# Altium schematic sheet BCK_REVA_3.SchDoc
size A4; SheetNumber: 3; SheetTotal: 3
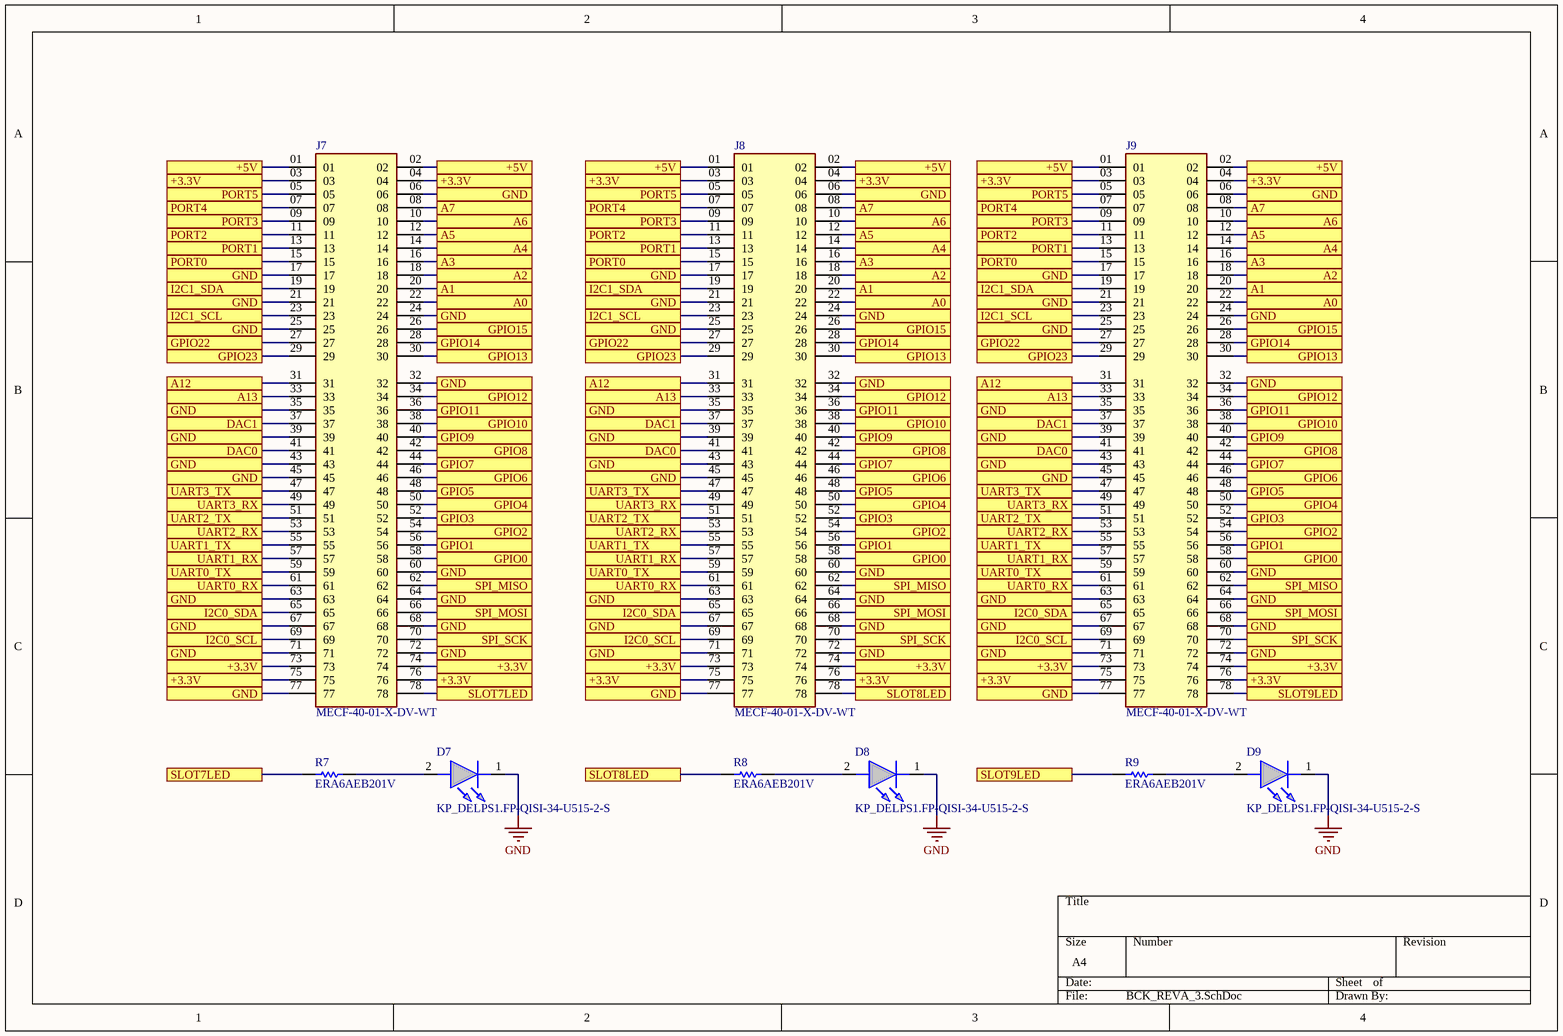
[diagram p0: BCK_REVA_3.SchDoc]

## Parts
D7  KP_DELPS1.FP-QISI-34-U515-2-S  [KPDELPS1FPQISI34U5152S]
D8  KP_DELPS1.FP-QISI-34-U515-2-S  [KPDELPS1FPQISI34U5152S]
D9  KP_DELPS1.FP-QISI-34-U515-2-S  [KPDELPS1FPQISI34U5152S]
J7  MECF-40-01-X-DV-WT  [SAMTEC_MECF-40-01-X-DV-WT]
J8  MECF-40-01-X-DV-WT  [SAMTEC_MECF-40-01-X-DV-WT]
J9  MECF-40-01-X-DV-WT  [SAMTEC_MECF-40-01-X-DV-WT]
R7  ERA6AEB201V  [RESC2013X60X40NL20T25]
R8  ERA6AEB201V  [RESC2013X60X40NL20T25]
R9  ERA6AEB201V  [RESC2013X60X40NL20T25]

## Ports
+3.3V (see BCK_REVA[1A], BCK_REVA[1C], BCK_REVA[2A], BCK_REVA[2C], BCK_REVA[3A], BCK_REVA[3C], BCK_REVA[4A], BCK_REVA[4C], BCK_REVA_2[1A], BCK_REVA_2[1C], BCK_REVA_2[2A], BCK_REVA_2[2C], BCK_REVA_2[3A], BCK_REVA_2[3C], BCK_REVA_2[4A], BCK_REVA_2[4C], BCK_REVA_3[1A], BCK_REVA_3[1C], BCK_REVA_3[2A], BCK_REVA_3[2C], BCK_REVA_3[3A], BCK_REVA_3[3C], BCK_REVA_3[4A], BCK_REVA_3[4C]), +3.3V (see BCK_REVA[1A], BCK_REVA[1C], BCK_REVA[2A], BCK_REVA[2C], BCK_REVA[3A], BCK_REVA[3C], BCK_REVA[4A], BCK_REVA[4C], BCK_REVA_2[1A], BCK_REVA_2[1C], BCK_REVA_2[2A], BCK_REVA_2[2C], BCK_REVA_2[3A], BCK_REVA_2[3C], BCK_REVA_2[4A], BCK_REVA_2[4C], BCK_REVA_3[1A], BCK_REVA_3[1C], BCK_REVA_3[2A], BCK_REVA_3[2C], BCK_REVA_3[3A], BCK_REVA_3[3C], BCK_REVA_3[4C]), +3.3V (see BCK_REVA[1A], BCK_REVA[1C], BCK_REVA[2A], BCK_REVA[2C], BCK_REVA[3A], BCK_REVA[3C], BCK_REVA[4A], BCK_REVA[4C], BCK_REVA_2[1A], BCK_REVA_2[1C], BCK_REVA_2[2A], BCK_REVA_2[2C], BCK_REVA_2[3A], BCK_REVA_2[3C], BCK_REVA_2[4A], BCK_REVA_2[4C], BCK_REVA_3[1C], BCK_REVA_3[2A], BCK_REVA_3[2C], BCK_REVA_3[3A], BCK_REVA_3[3C], BCK_REVA_3[4A], BCK_REVA_3[4C]), +5V (see BCK_REVA[1A], BCK_REVA[2A], BCK_REVA[3A], BCK_REVA[4A], BCK_REVA_2[1A], BCK_REVA_2[2A], BCK_REVA_2[3A], BCK_REVA_2[4A], BCK_REVA_3[1A], BCK_REVA_3[2A], BCK_REVA_3[3A]), +5V (see BCK_REVA[1A], BCK_REVA[2A], BCK_REVA[3A], BCK_REVA[4A], BCK_REVA_2[1A], BCK_REVA_2[2A], BCK_REVA_2[3A], BCK_REVA_2[4A], BCK_REVA_3[1A], BCK_REVA_3[2A], BCK_REVA_3[3A], BCK_REVA_3[4A]), +5V (see BCK_REVA[1A], BCK_REVA[2A], BCK_REVA[3A], BCK_REVA[4A], BCK_REVA_2[1A], BCK_REVA_2[2A], BCK_REVA_2[3A], BCK_REVA_2[4A], BCK_REVA_3[2A], BCK_REVA_3[3A], BCK_REVA_3[4A]), A0 (see BCK_REVA[2B], BCK_REVA[3B], BCK_REVA[4B], BCK_REVA_2[2B], BCK_REVA_2[3B], BCK_REVA_2[4B], BCK_REVA_3[2B], BCK_REVA_3[3B]), A0 (see BCK_REVA[2B], BCK_REVA[3B], BCK_REVA[4B], BCK_REVA_2[2B], BCK_REVA_2[3B], BCK_REVA_2[4B], BCK_REVA_3[2B], BCK_REVA_3[4B]), A0 (see BCK_REVA[2B], BCK_REVA[3B], BCK_REVA[4B], BCK_REVA_2[2B], BCK_REVA_2[3B], BCK_REVA_2[4B], BCK_REVA_3[3B], BCK_REVA_3[4B]), A1 (see BCK_REVA[2B], BCK_REVA[3B], BCK_REVA[4B], BCK_REVA_2[2B], BCK_REVA_2[3B], BCK_REVA_2[4B], BCK_REVA_3[2B], BCK_REVA_3[3B]), A1 (see BCK_REVA[2B], BCK_REVA[3B], BCK_REVA[4B], BCK_REVA_2[2B], BCK_REVA_2[3B], BCK_REVA_2[4B], BCK_REVA_3[2B], BCK_REVA_3[4B]), A1 (see BCK_REVA[2B], BCK_REVA[3B], BCK_REVA[4B], BCK_REVA_2[2B], BCK_REVA_2[3B], BCK_REVA_2[4B], BCK_REVA_3[3B], BCK_REVA_3[4B]), A2 (see BCK_REVA[2B], BCK_REVA[3B], BCK_REVA[4B], BCK_REVA_2[2B], BCK_REVA_2[3B], BCK_REVA_2[4B], BCK_REVA_3[2B], BCK_REVA_3[3B]), A2 (see BCK_REVA[2B], BCK_REVA[3B], BCK_REVA[4B], BCK_REVA_2[2B], BCK_REVA_2[3B], BCK_REVA_2[4B], BCK_REVA_3[2B], BCK_REVA_3[4B]), A2 (see BCK_REVA[2B], BCK_REVA[3B], BCK_REVA[4B], BCK_REVA_2[2B], BCK_REVA_2[3B], BCK_REVA_2[4B], BCK_REVA_3[3B], BCK_REVA_3[4B]), A3 (see BCK_REVA[2B], BCK_REVA[3B], BCK_REVA[4B], BCK_REVA_2[2B], BCK_REVA_2[3B], BCK_REVA_2[4B], BCK_REVA_3[2B], BCK_REVA_3[3B]), A3 (see BCK_REVA[2B], BCK_REVA[3B], BCK_REVA[4B], BCK_REVA_2[2B], BCK_REVA_2[3B], BCK_REVA_2[4B], BCK_REVA_3[2B], BCK_REVA_3[4B]), A3 (see BCK_REVA[2B], BCK_REVA[3B], BCK_REVA[4B], BCK_REVA_2[2B], BCK_REVA_2[3B], BCK_REVA_2[4B], BCK_REVA_3[3B], BCK_REVA_3[4B]), A4 (see BCK_REVA[2A], BCK_REVA[3A], BCK_REVA[4A], BCK_REVA_2[2A], BCK_REVA_2[3A], BCK_REVA_2[4A], BCK_REVA_3[2A], BCK_REVA_3[3A]), A4 (see BCK_REVA[2A], BCK_REVA[3A], BCK_REVA[4A], BCK_REVA_2[2A], BCK_REVA_2[3A], BCK_REVA_2[4A], BCK_REVA_3[2A], BCK_REVA_3[4A]), A4 (see BCK_REVA[2A], BCK_REVA[3A], BCK_REVA[4A], BCK_REVA_2[2A], BCK_REVA_2[3A], BCK_REVA_2[4A], BCK_REVA_3[3A], BCK_REVA_3[4A]), A5 (see BCK_REVA[2A], BCK_REVA[3A], BCK_REVA[4A], BCK_REVA_2[2A], BCK_REVA_2[3A], BCK_REVA_2[4A], BCK_REVA_3[2A], BCK_REVA_3[3A]), A5 (see BCK_REVA[2A], BCK_REVA[3A], BCK_REVA[4A], BCK_REVA_2[2A], BCK_REVA_2[3A], BCK_REVA_2[4A], BCK_REVA_3[2A], BCK_REVA_3[4A]), A5 (see BCK_REVA[2A], BCK_REVA[3A], BCK_REVA[4A], BCK_REVA_2[2A], BCK_REVA_2[3A], BCK_REVA_2[4A], BCK_REVA_3[3A], BCK_REVA_3[4A]), A6 (see BCK_REVA[2A], BCK_REVA[3A], BCK_REVA[4A], BCK_REVA_2[2A], BCK_REVA_2[3A], BCK_REVA_2[4A], BCK_REVA_3[2A], BCK_REVA_3[3A]), A6 (see BCK_REVA[2A], BCK_REVA[3A], BCK_REVA[4A], BCK_REVA_2[2A], BCK_REVA_2[3A], BCK_REVA_2[4A], BCK_REVA_3[2A], BCK_REVA_3[4A]), A6 (see BCK_REVA[2A], BCK_REVA[3A], BCK_REVA[4A], BCK_REVA_2[2A], BCK_REVA_2[3A], BCK_REVA_2[4A], BCK_REVA_3[3A], BCK_REVA_3[4A]), A7 (see BCK_REVA[2A], BCK_REVA[3A], BCK_REVA[4A], BCK_REVA_2[2A], BCK_REVA_2[3A], BCK_REVA_2[4A], BCK_REVA_3[2A], BCK_REVA_3[3A]), A7 (see BCK_REVA[2A], BCK_REVA[3A], BCK_REVA[4A], BCK_REVA_2[2A], BCK_REVA_2[3A], BCK_REVA_2[4A], BCK_REVA_3[2A], BCK_REVA_3[4A]), A7 (see BCK_REVA[2A], BCK_REVA[3A], BCK_REVA[4A], BCK_REVA_2[2A], BCK_REVA_2[3A], BCK_REVA_2[4A], BCK_REVA_3[3A], BCK_REVA_3[4A]), A12 (see BCK_REVA[1B], BCK_REVA[2B], BCK_REVA[3B], BCK_REVA_2[1B], BCK_REVA_2[2B], BCK_REVA_2[3B], BCK_REVA_3[1B], BCK_REVA_3[2B]), A12 (see BCK_REVA[1B], BCK_REVA[2B], BCK_REVA[3B], BCK_REVA_2[1B], BCK_REVA_2[2B], BCK_REVA_2[3B], BCK_REVA_3[1B], BCK_REVA_3[3B]), A12 (see BCK_REVA[1B], BCK_REVA[2B], BCK_REVA[3B], BCK_REVA_2[1B], BCK_REVA_2[2B], BCK_REVA_2[3B], BCK_REVA_3[2B], BCK_REVA_3[3B]), A13 (see BCK_REVA[1B], BCK_REVA[2B], BCK_REVA[3B], BCK_REVA_2[1B], BCK_REVA_2[2B], BCK_REVA_2[3B], BCK_REVA_3[1B], BCK_REVA_3[2B]), A13 (see BCK_REVA[1B], BCK_REVA[2B], BCK_REVA[3B], BCK_REVA_2[1B], BCK_REVA_2[2B], BCK_REVA_2[3B], BCK_REVA_3[1B], BCK_REVA_3[3B]), A13 (see BCK_REVA[1B], BCK_REVA[2B], BCK_REVA[3B], BCK_REVA_2[1B], BCK_REVA_2[2B], BCK_REVA_2[3B], BCK_REVA_3[2B], BCK_REVA_3[3B]), DAC0 (see BCK_REVA[1B], BCK_REVA[2B], BCK_REVA[3B], BCK_REVA_2[1B], BCK_REVA_2[2B], BCK_REVA_2[3B], BCK_REVA_3[1B], BCK_REVA_3[2B]), DAC0 (see BCK_REVA[1B], BCK_REVA[2B], BCK_REVA[3B], BCK_REVA_2[1B], BCK_REVA_2[2B], BCK_REVA_2[3B], BCK_REVA_3[1B], BCK_REVA_3[3B]), DAC0 (see BCK_REVA[1B], BCK_REVA[2B], BCK_REVA[3B], BCK_REVA_2[1B], BCK_REVA_2[2B], BCK_REVA_2[3B], BCK_REVA_3[2B], BCK_REVA_3[3B]), DAC1 (see BCK_REVA[1B], BCK_REVA[2B], BCK_REVA[3B], BCK_REVA_2[1B], BCK_REVA_2[2B], BCK_REVA_2[3B], BCK_REVA_3[1B], BCK_REVA_3[2B]), DAC1 (see BCK_REVA[1B], BCK_REVA[2B], BCK_REVA[3B], BCK_REVA_2[1B], BCK_REVA_2[2B], BCK_REVA_2[3B], BCK_REVA_3[1B], BCK_REVA_3[3B]), DAC1 (see BCK_REVA[1B], BCK_REVA[2B], BCK_REVA[3B], BCK_REVA_2[1B], BCK_REVA_2[2B], BCK_REVA_2[3B], BCK_REVA_3[2B], BCK_REVA_3[3B]), GND (see BCK_REVA[1B], BCK_REVA[1C], BCK_REVA[1D], BCK_REVA[2A], BCK_REVA[2B], BCK_REVA[2C], BCK_REVA[3A], BCK_REVA[3B], BCK_REVA[3C], BCK_REVA[4A], BCK_REVA[4B], BCK_REVA[4C], BCK_REVA_2[1B], BCK_REVA_2[1C], BCK_REVA_2[2A], BCK_REVA_2[2B], BCK_REVA_2[2C], BCK_REVA_2[3A], BCK_REVA_2[3B], BCK_REVA_2[3C], BCK_REVA_2[4A], BCK_REVA_2[4B], BCK_REVA_2[4C], BCK_REVA_3[1B], BCK_REVA_3[1C], BCK_REVA_3[2A], BCK_REVA_3[2B], BCK_REVA_3[2C], BCK_REVA_3[3A], BCK_REVA_3[3B], BCK_REVA_3[3C], BCK_REVA_3[4A], BCK_REVA_3[4B], BCK_REVA_3[4C]), GND (see BCK_REVA[1B], BCK_REVA[1C], BCK_REVA[1D], BCK_REVA[2A], BCK_REVA[2B], BCK_REVA[2C], BCK_REVA[3A], BCK_REVA[3B], BCK_REVA[3C], BCK_REVA[4A], BCK_REVA[4B], BCK_REVA[4C], BCK_REVA_2[1B], BCK_REVA_2[1C], BCK_REVA_2[2A], BCK_REVA_2[2B], BCK_REVA_2[2C], BCK_REVA_2[3A], BCK_REVA_2[3B], BCK_REVA_2[3C], BCK_REVA_2[4A], BCK_REVA_2[4B], BCK_REVA_2[4C], BCK_REVA_3[1B], BCK_REVA_3[1C], BCK_REVA_3[2A], BCK_REVA_3[2B], BCK_REVA_3[2C], BCK_REVA_3[3A], BCK_REVA_3[3B], BCK_REVA_3[3C], BCK_REVA_3[4B], BCK_REVA_3[4C]), GND (see BCK_REVA[1B], BCK_REVA[1C], BCK_REVA[1D], BCK_REVA[2A], BCK_REVA[2B], BCK_REVA[2C], BCK_REVA[3A], BCK_REVA[3B], BCK_REVA[3C], BCK_REVA[4A], BCK_REVA[4B], BCK_REVA[4C], BCK_REVA_2[1B], BCK_REVA_2[1C], BCK_REVA_2[2A], BCK_REVA_2[2B], BCK_REVA_2[2C], BCK_REVA_2[3A], BCK_REVA_2[3B], BCK_REVA_2[3C], BCK_REVA_2[4A], BCK_REVA_2[4B], BCK_REVA_2[4C], BCK_REVA_3[1B], BCK_REVA_3[1C], BCK_REVA_3[2A], BCK_REVA_3[2B], BCK_REVA_3[2C], BCK_REVA_3[3B], BCK_REVA_3[3C], BCK_REVA_3[4A], BCK_REVA_3[4B], BCK_REVA_3[4C]), GND (see BCK_REVA[1B], BCK_REVA[1C], BCK_REVA[1D], BCK_REVA[2A], BCK_REVA[2B], BCK_REVA[2C], BCK_REVA[3A], BCK_REVA[3B], BCK_REVA[3C], BCK_REVA[4A], BCK_REVA[4B], BCK_REVA[4C], BCK_REVA_2[1B], BCK_REVA_2[1C], BCK_REVA_2[2A], BCK_REVA_2[2B], BCK_REVA_2[2C], BCK_REVA_2[3A], BCK_REVA_2[3B], BCK_REVA_2[3C], BCK_REVA_2[4A], BCK_REVA_2[4B], BCK_REVA_2[4C], BCK_REVA_3[1B], BCK_REVA_3[1C], BCK_REVA_3[2B], BCK_REVA_3[2C], BCK_REVA_3[3A], BCK_REVA_3[3B], BCK_REVA_3[3C], BCK_REVA_3[4A], BCK_REVA_3[4B], BCK_REVA_3[4C]), GPIO0 (see BCK_REVA[2C], BCK_REVA[3C], BCK_REVA[4C], BCK_REVA_2[2C], BCK_REVA_2[3C], BCK_REVA_2[4C], BCK_REVA_3[2C], BCK_REVA_3[3C]), GPIO0 (see BCK_REVA[2C], BCK_REVA[3C], BCK_REVA[4C], BCK_REVA_2[2C], BCK_REVA_2[3C], BCK_REVA_2[4C], BCK_REVA_3[2C], BCK_REVA_3[4C]), GPIO0 (see BCK_REVA[2C], BCK_REVA[3C], BCK_REVA[4C], BCK_REVA_2[2C], BCK_REVA_2[3C], BCK_REVA_2[4C], BCK_REVA_3[3C], BCK_REVA_3[4C]), GPIO1 (see BCK_REVA[2C], BCK_REVA[3C], BCK_REVA[4C], BCK_REVA_2[2C], BCK_REVA_2[3C], BCK_REVA_2[4C], BCK_REVA_3[2C], BCK_REVA_3[3C]), GPIO1 (see BCK_REVA[2C], BCK_REVA[3C], BCK_REVA[4C], BCK_REVA_2[2C], BCK_REVA_2[3C], BCK_REVA_2[4C], BCK_REVA_3[2C], BCK_REVA_3[4C]), GPIO1 (see BCK_REVA[2C], BCK_REVA[3C], BCK_REVA[4C], BCK_REVA_2[2C], BCK_REVA_2[3C], BCK_REVA_2[4C], BCK_REVA_3[3C], BCK_REVA_3[4C]), GPIO2 (see BCK_REVA[2C], BCK_REVA[3C], BCK_REVA[4C], BCK_REVA_2[2C], BCK_REVA_2[3C], BCK_REVA_2[4C], BCK_REVA_3[2C], BCK_REVA_3[3C]), GPIO2 (see BCK_REVA[2C], BCK_REVA[3C], BCK_REVA[4C], BCK_REVA_2[2C], BCK_REVA_2[3C], BCK_REVA_2[4C], BCK_REVA_3[2C], BCK_REVA_3[4C]), GPIO2 (see BCK_REVA[2C], BCK_REVA[3C], BCK_REVA[4C], BCK_REVA_2[2C], BCK_REVA_2[3C], BCK_REVA_2[4C], BCK_REVA_3[3C], BCK_REVA_3[4C]), GPIO3 (see BCK_REVA[2C], BCK_REVA[3C], BCK_REVA[4C], BCK_REVA_2[2C], BCK_REVA_2[3C], BCK_REVA_2[4C], BCK_REVA_3[2C], BCK_REVA_3[3C]), GPIO3 (see BCK_REVA[2C], BCK_REVA[3C], BCK_REVA[4C], BCK_REVA_2[2C], BCK_REVA_2[3C], BCK_REVA_2[4C], BCK_REVA_3[2C], BCK_REVA_3[4C]), GPIO3 (see BCK_REVA[2C], BCK_REVA[3C], BCK_REVA[4C], BCK_REVA_2[2C], BCK_REVA_2[3C], BCK_REVA_2[4C], BCK_REVA_3[3C], BCK_REVA_3[4C]), GPIO4 (see BCK_REVA[2B], BCK_REVA[3B], BCK_REVA[4B], BCK_REVA_2[2B], BCK_REVA_2[3B], BCK_REVA_2[4B], BCK_REVA_3[2B], BCK_REVA_3[3B]), GPIO4 (see BCK_REVA[2B], BCK_REVA[3B], BCK_REVA[4B], BCK_REVA_2[2B], BCK_REVA_2[3B], BCK_REVA_2[4B], BCK_REVA_3[2B], BCK_REVA_3[4B]), GPIO4 (see BCK_REVA[2B], BCK_REVA[3B], BCK_REVA[4B], BCK_REVA_2[2B], BCK_REVA_2[3B], BCK_REVA_2[4B], BCK_REVA_3[3B], BCK_REVA_3[4B]), GPIO5 (see BCK_REVA[2B], BCK_REVA[3B], BCK_REVA[4B], BCK_REVA_2[2B], BCK_REVA_2[3B], BCK_REVA_2[4B], BCK_REVA_3[2B], BCK_REVA_3[3B]), GPIO5 (see BCK_REVA[2B], BCK_REVA[3B], BCK_REVA[4B], BCK_REVA_2[2B], BCK_REVA_2[3B], BCK_REVA_2[4B], BCK_REVA_3[2B], BCK_REVA_3[4B]), GPIO5 (see BCK_REVA[2B], BCK_REVA[3B], BCK_REVA[4B], BCK_REVA_2[2B], BCK_REVA_2[3B], BCK_REVA_2[4B], BCK_REVA_3[3B], BCK_REVA_3[4B]), GPIO6 (see BCK_REVA[2B], BCK_REVA[3B], BCK_REVA[4B], BCK_REVA_2[2B], BCK_REVA_2[3B], BCK_REVA_2[4B], BCK_REVA_3[2B], BCK_REVA_3[3B]), GPIO6 (see BCK_REVA[2B], BCK_REVA[3B], BCK_REVA[4B], BCK_REVA_2[2B], BCK_REVA_2[3B], BCK_REVA_2[4B], BCK_REVA_3[2B], BCK_REVA_3[4B]), GPIO6 (see BCK_REVA[2B], BCK_REVA[3B], BCK_REVA[4B], BCK_REVA_2[2B], BCK_REVA_2[3B], BCK_REVA_2[4B], BCK_REVA_3[3B], BCK_REVA_3[4B]), GPIO7 (see BCK_REVA[2B], BCK_REVA[3B], BCK_REVA[4B], BCK_REVA_2[2B], BCK_REVA_2[3B], BCK_REVA_2[4B], BCK_REVA_3[2B], BCK_REVA_3[3B]), GPIO7 (see BCK_REVA[2B], BCK_REVA[3B], BCK_REVA[4B], BCK_REVA_2[2B], BCK_REVA_2[3B], BCK_REVA_2[4B], BCK_REVA_3[2B], BCK_REVA_3[4B]), GPIO7 (see BCK_REVA[2B], BCK_REVA[3B], BCK_REVA[4B], BCK_REVA_2[2B], BCK_REVA_2[3B], BCK_REVA_2[4B], BCK_REVA_3[3B], BCK_REVA_3[4B]), GPIO8 (see BCK_REVA[2B], BCK_REVA[3B], BCK_REVA[4B], BCK_REVA_2[2B], BCK_REVA_2[3B], BCK_REVA_2[4B], BCK_REVA_3[2B], BCK_REVA_3[3B]), GPIO8 (see BCK_REVA[2B], BCK_REVA[3B], BCK_REVA[4B], BCK_REVA_2[2B], BCK_REVA_2[3B], BCK_REVA_2[4B], BCK_REVA_3[2B], BCK_REVA_3[4B]), GPIO8 (see BCK_REVA[2B], BCK_REVA[3B], BCK_REVA[4B], BCK_REVA_2[2B], BCK_REVA_2[3B], BCK_REVA_2[4B], BCK_REVA_3[3B], BCK_REVA_3[4B]), GPIO9 (see BCK_REVA[2B], BCK_REVA[3B], BCK_REVA[4B], BCK_REVA_2[2B], BCK_REVA_2[3B], BCK_REVA_2[4B], BCK_REVA_3[2B], BCK_REVA_3[3B]), GPIO9 (see BCK_REVA[2B], BCK_REVA[3B], BCK_REVA[4B], BCK_REVA_2[2B], BCK_REVA_2[3B], BCK_REVA_2[4B], BCK_REVA_3[2B], BCK_REVA_3[4B]), GPIO9 (see BCK_REVA[2B], BCK_REVA[3B], BCK_REVA[4B], BCK_REVA_2[2B], BCK_REVA_2[3B], BCK_REVA_2[4B], BCK_REVA_3[3B], BCK_REVA_3[4B]), GPIO10 (see BCK_REVA[2B], BCK_REVA[3B], BCK_REVA[4B], BCK_REVA_2[2B], BCK_REVA_2[3B], BCK_REVA_2[4B], BCK_REVA_3[2B], BCK_REVA_3[3B]), GPIO10 (see BCK_REVA[2B], BCK_REVA[3B], BCK_REVA[4B], BCK_REVA_2[2B], BCK_REVA_2[3B], BCK_REVA_2[4B], BCK_REVA_3[2B], BCK_REVA_3[4B]), GPIO10 (see BCK_REVA[2B], BCK_REVA[3B], BCK_REVA[4B], BCK_REVA_2[2B], BCK_REVA_2[3B], BCK_REVA_2[4B], BCK_REVA_3[3B], BCK_REVA_3[4B]), GPIO11 (see BCK_REVA[2B], BCK_REVA[3B], BCK_REVA[4B], BCK_REVA_2[2B], BCK_REVA_2[3B], BCK_REVA_2[4B], BCK_REVA_3[2B], BCK_REVA_3[3B]), GPIO11 (see BCK_REVA[2B], BCK_REVA[3B], BCK_REVA[4B], BCK_REVA_2[2B], BCK_REVA_2[3B], BCK_REVA_2[4B], BCK_REVA_3[2B], BCK_REVA_3[4B]), GPIO11 (see BCK_REVA[2B], BCK_REVA[3B], BCK_REVA[4B], BCK_REVA_2[2B], BCK_REVA_2[3B], BCK_REVA_2[4B], BCK_REVA_3[3B], BCK_REVA_3[4B]), GPIO12 (see BCK_REVA[2B], BCK_REVA[3B], BCK_REVA[4B], BCK_REVA_2[2B], BCK_REVA_2[3B], BCK_REVA_2[4B], BCK_REVA_3[2B], BCK_REVA_3[3B]), GPIO12 (see BCK_REVA[2B], BCK_REVA[3B], BCK_REVA[4B], BCK_REVA_2[2B], BCK_REVA_2[3B], BCK_REVA_2[4B], BCK_REVA_3[2B], BCK_REVA_3[4B]), GPIO12 (see BCK_REVA[2B], BCK_REVA[3B], BCK_REVA[4B], BCK_REVA_2[2B], BCK_REVA_2[3B], BCK_REVA_2[4B], BCK_REVA_3[3B], BCK_REVA_3[4B]), GPIO13 (see BCK_REVA[2B], BCK_REVA[3B], BCK_REVA[4B], BCK_REVA_2[2B], BCK_REVA_2[3B], BCK_REVA_2[4B], BCK_REVA_3[2B], BCK_REVA_3[3B]), GPIO13 (see BCK_REVA[2B], BCK_REVA[3B], BCK_REVA[4B], BCK_REVA_2[2B], BCK_REVA_2[3B], BCK_REVA_2[4B], BCK_REVA_3[2B], BCK_REVA_3[4B]), GPIO13 (see BCK_REVA[2B], BCK_REVA[3B], BCK_REVA[4B], BCK_REVA_2[2B], BCK_REVA_2[3B], BCK_REVA_2[4B], BCK_REVA_3[3B], BCK_REVA_3[4B]), GPIO14 (see BCK_REVA[2B], BCK_REVA[3B], BCK_REVA[4B], BCK_REVA_2[2B], BCK_REVA_2[3B], BCK_REVA_2[4B], BCK_REVA_3[2B], BCK_REVA_3[3B]), GPIO14 (see BCK_REVA[2B], BCK_REVA[3B], BCK_REVA[4B], BCK_REVA_2[2B], BCK_REVA_2[3B], BCK_REVA_2[4B], BCK_REVA_3[2B], BCK_REVA_3[4B]), GPIO14 (see BCK_REVA[2B], BCK_REVA[3B], BCK_REVA[4B], BCK_REVA_2[2B], BCK_REVA_2[3B], BCK_REVA_2[4B], BCK_REVA_3[3B], BCK_REVA_3[4B]), GPIO15 (see BCK_REVA[2B], BCK_REVA[3B], BCK_REVA[4B], BCK_REVA_2[2B], BCK_REVA_2[3B], BCK_REVA_2[4B], BCK_REVA_3[2B], BCK_REVA_3[3B]), GPIO15 (see BCK_REVA[2B], BCK_REVA[3B], BCK_REVA[4B], BCK_REVA_2[2B], BCK_REVA_2[3B], BCK_REVA_2[4B], BCK_REVA_3[2B], BCK_REVA_3[4B]), GPIO15 (see BCK_REVA[2B], BCK_REVA[3B], BCK_REVA[4B], BCK_REVA_2[2B], BCK_REVA_2[3B], BCK_REVA_2[4B], BCK_REVA_3[3B], BCK_REVA_3[4B]), GPIO22 (see BCK_REVA[1B], BCK_REVA[2B], BCK_REVA[3B], BCK_REVA_2[1B], BCK_REVA_2[2B], BCK_REVA_2[3B], BCK_REVA_3[1B], BCK_REVA_3[2B]), GPIO22 (see BCK_REVA[1B], BCK_REVA[2B], BCK_REVA[3B], BCK_REVA_2[1B], BCK_REVA_2[2B], BCK_REVA_2[3B], BCK_REVA_3[1B], BCK_REVA_3[3B]), GPIO22 (see BCK_REVA[1B], BCK_REVA[2B], BCK_REVA[3B], BCK_REVA_2[1B], BCK_REVA_2[2B], BCK_REVA_2[3B], BCK_REVA_3[2B], BCK_REVA_3[3B]), GPIO23 (see BCK_REVA[1B], BCK_REVA[2B], BCK_REVA[3B], BCK_REVA_2[1B], BCK_REVA_2[2B], BCK_REVA_2[3B], BCK_REVA_3[1B], BCK_REVA_3[2B]), GPIO23 (see BCK_REVA[1B], BCK_REVA[2B], BCK_REVA[3B], BCK_REVA_2[1B], BCK_REVA_2[2B], BCK_REVA_2[3B], BCK_REVA_3[1B], BCK_REVA_3[3B]), GPIO23 (see BCK_REVA[1B], BCK_REVA[2B], BCK_REVA[3B], BCK_REVA_2[1B], BCK_REVA_2[2B], BCK_REVA_2[3B], BCK_REVA_3[2B], BCK_REVA_3[3B]), I2C0_SCL (see BCK_REVA[1C], BCK_REVA[2C], BCK_REVA[3C], BCK_REVA_2[1C], BCK_REVA_2[2C], BCK_REVA_2[3C], BCK_REVA_3[1C], BCK_REVA_3[2C]), I2C0_SCL (see BCK_REVA[1C], BCK_REVA[2C], BCK_REVA[3C], BCK_REVA_2[1C], BCK_REVA_2[2C], BCK_REVA_2[3C], BCK_REVA_3[1C], BCK_REVA_3[3C]), I2C0_SCL (see BCK_REVA[1C], BCK_REVA[2C], BCK_REVA[3C], BCK_REVA_2[1C], BCK_REVA_2[2C], BCK_REVA_2[3C], BCK_REVA_3[2C], BCK_REVA_3[3C]), I2C0_SDA (see BCK_REVA[1C], BCK_REVA[2C], BCK_REVA[3C], BCK_REVA_2[1C], BCK_REVA_2[2C], BCK_REVA_2[3C], BCK_REVA_3[1C], BCK_REVA_3[2C]), I2C0_SDA (see BCK_REVA[1C], BCK_REVA[2C], BCK_REVA[3C], BCK_REVA_2[1C], BCK_REVA_2[2C], BCK_REVA_2[3C], BCK_REVA_3[1C], BCK_REVA_3[3C]), I2C0_SDA (see BCK_REVA[1C], BCK_REVA[2C], BCK_REVA[3C], BCK_REVA_2[1C], BCK_REVA_2[2C], BCK_REVA_2[3C], BCK_REVA_3[2C], BCK_REVA_3[3C]), I2C1_SCL (see BCK_REVA[1B], BCK_REVA[2B], BCK_REVA[3B], BCK_REVA_2[1B], BCK_REVA_2[2B], BCK_REVA_2[3B], BCK_REVA_3[1B], BCK_REVA_3[2B]), I2C1_SCL (see BCK_REVA[1B], BCK_REVA[2B], BCK_REVA[3B], BCK_REVA_2[1B], BCK_REVA_2[2B], BCK_REVA_2[3B], BCK_REVA_3[1B], BCK_REVA_3[3B]), I2C1_SCL (see BCK_REVA[1B], BCK_REVA[2B], BCK_REVA[3B], BCK_REVA_2[1B], BCK_REVA_2[2B], BCK_REVA_2[3B], BCK_REVA_3[2B], BCK_REVA_3[3B]), I2C1_SDA (see BCK_REVA[1B], BCK_REVA[2B], BCK_REVA[3B], BCK_REVA_2[1B], BCK_REVA_2[2B], BCK_REVA_2[3B], BCK_REVA_3[1B], BCK_REVA_3[2B]), I2C1_SDA (see BCK_REVA[1B], BCK_REVA[2B], BCK_REVA[3B], BCK_REVA_2[1B], BCK_REVA_2[2B], BCK_REVA_2[3B], BCK_REVA_3[1B], BCK_REVA_3[3B]), I2C1_SDA (see BCK_REVA[1B], BCK_REVA[2B], BCK_REVA[3B], BCK_REVA_2[1B], BCK_REVA_2[2B], BCK_REVA_2[3B], BCK_REVA_3[2B], BCK_REVA_3[3B]), PORT0 (see BCK_REVA[1B], BCK_REVA[2B], BCK_REVA[3B], BCK_REVA_2[1B], BCK_REVA_2[2B], BCK_REVA_2[3B], BCK_REVA_3[1B], BCK_REVA_3[2B]), PORT0 (see BCK_REVA[1B], BCK_REVA[2B], BCK_REVA[3B], BCK_REVA_2[1B], BCK_REVA_2[2B], BCK_REVA_2[3B], BCK_REVA_3[1B], BCK_REVA_3[3B]), PORT0 (see BCK_REVA[1B], BCK_REVA[2B], BCK_REVA[3B], BCK_REVA_2[1B], BCK_REVA_2[2B], BCK_REVA_2[3B], BCK_REVA_3[2B], BCK_REVA_3[3B]), PORT1 (see BCK_REVA[1A], BCK_REVA[2A], BCK_REVA[3A], BCK_REVA_2[1A], BCK_REVA_2[2A], BCK_REVA_2[3A], BCK_REVA_3[1A], BCK_REVA_3[2A]), PORT1 (see BCK_REVA[1A], BCK_REVA[2A], BCK_REVA[3A], BCK_REVA_2[1A], BCK_REVA_2[2A], BCK_REVA_2[3A], BCK_REVA_3[1A], BCK_REVA_3[3A]), PORT1 (see BCK_REVA[1A], BCK_REVA[2A], BCK_REVA[3A], BCK_REVA_2[1A], BCK_REVA_2[2A], BCK_REVA_2[3A], BCK_REVA_3[2A], BCK_REVA_3[3A]), PORT2 (see BCK_REVA[1A], BCK_REVA[2A], BCK_REVA[3A], BCK_REVA_2[1A], BCK_REVA_2[2A], BCK_REVA_2[3A], BCK_REVA_3[1A], BCK_REVA_3[2A]), PORT2 (see BCK_REVA[1A], BCK_REVA[2A], BCK_REVA[3A], BCK_REVA_2[1A], BCK_REVA_2[2A], BCK_REVA_2[3A], BCK_REVA_3[1A], BCK_REVA_3[3A]), PORT2 (see BCK_REVA[1A], BCK_REVA[2A], BCK_REVA[3A], BCK_REVA_2[1A], BCK_REVA_2[2A], BCK_REVA_2[3A], BCK_REVA_3[2A], BCK_REVA_3[3A]), PORT3 (see BCK_REVA[1A], BCK_REVA[2A], BCK_REVA[3A], BCK_REVA_2[1A], BCK_REVA_2[2A], BCK_REVA_2[3A], BCK_REVA_3[1A], BCK_REVA_3[2A]), PORT3 (see BCK_REVA[1A], BCK_REVA[2A], BCK_REVA[3A], BCK_REVA_2[1A], BCK_REVA_2[2A], BCK_REVA_2[3A], BCK_REVA_3[1A], BCK_REVA_3[3A]), PORT3 (see BCK_REVA[1A], BCK_REVA[2A], BCK_REVA[3A], BCK_REVA_2[1A], BCK_REVA_2[2A], BCK_REVA_2[3A], BCK_REVA_3[2A], BCK_REVA_3[3A]), PORT4 (see BCK_REVA[1A], BCK_REVA[2A], BCK_REVA[3A], BCK_REVA_2[1A], BCK_REVA_2[2A], BCK_REVA_2[3A], BCK_REVA_3[1A], BCK_REVA_3[2A]), PORT4 (see BCK_REVA[1A], BCK_REVA[2A], BCK_REVA[3A], BCK_REVA_2[1A], BCK_REVA_2[2A], BCK_REVA_2[3A], BCK_REVA_3[1A], BCK_REVA_3[3A]), PORT4 (see BCK_REVA[1A], BCK_REVA[2A], BCK_REVA[3A], BCK_REVA_2[1A], BCK_REVA_2[2A], BCK_REVA_2[3A], BCK_REVA_3[2A], BCK_REVA_3[3A]), PORT5 (see BCK_REVA[1A], BCK_REVA[2A], BCK_REVA[3A], BCK_REVA_2[1A], BCK_REVA_2[2A], BCK_REVA_2[3A], BCK_REVA_3[1A], BCK_REVA_3[2A]), PORT5 (see BCK_REVA[1A], BCK_REVA[2A], BCK_REVA[3A], BCK_REVA_2[1A], BCK_REVA_2[2A], BCK_REVA_2[3A], BCK_REVA_3[1A], BCK_REVA_3[3A]), PORT5 (see BCK_REVA[1A], BCK_REVA[2A], BCK_REVA[3A], BCK_REVA_2[1A], BCK_REVA_2[2A], BCK_REVA_2[3A], BCK_REVA_3[2A], BCK_REVA_3[3A]), SLOT7LED (see BCK_REVA_3[1D]), SLOT7LED (see BCK_REVA_3[2C]), SLOT8LED (see BCK_REVA_3[2D]), SLOT8LED (see BCK_REVA_3[3C]), SLOT9LED (see BCK_REVA_3[3D]), SLOT9LED (see BCK_REVA_3[4C]), SPI_MISO (see BCK_REVA[2C], BCK_REVA[3C], BCK_REVA[4C], BCK_REVA_2[2C], BCK_REVA_2[3C], BCK_REVA_2[4C], BCK_REVA_3[2C], BCK_REVA_3[3C]), SPI_MISO (see BCK_REVA[2C], BCK_REVA[3C], BCK_REVA[4C], BCK_REVA_2[2C], BCK_REVA_2[3C], BCK_REVA_2[4C], BCK_REVA_3[2C], BCK_REVA_3[4C]), SPI_MISO (see BCK_REVA[2C], BCK_REVA[3C], BCK_REVA[4C], BCK_REVA_2[2C], BCK_REVA_2[3C], BCK_REVA_2[4C], BCK_REVA_3[3C], BCK_REVA_3[4C]), SPI_MOSI (see BCK_REVA[2C], BCK_REVA[3C], BCK_REVA[4C], BCK_REVA_2[2C], BCK_REVA_2[3C], BCK_REVA_2[4C], BCK_REVA_3[2C], BCK_REVA_3[3C]), SPI_MOSI (see BCK_REVA[2C], BCK_REVA[3C], BCK_REVA[4C], BCK_REVA_2[2C], BCK_REVA_2[3C], BCK_REVA_2[4C], BCK_REVA_3[2C], BCK_REVA_3[4C]), SPI_MOSI (see BCK_REVA[2C], BCK_REVA[3C], BCK_REVA[4C], BCK_REVA_2[2C], BCK_REVA_2[3C], BCK_REVA_2[4C], BCK_REVA_3[3C], BCK_REVA_3[4C]), SPI_SCK (see BCK_REVA[2C], BCK_REVA[3C], BCK_REVA[4C], BCK_REVA_2[2C], BCK_REVA_2[3C], BCK_REVA_2[4C], BCK_REVA_3[2C], BCK_REVA_3[3C]), SPI_SCK (see BCK_REVA[2C], BCK_REVA[3C], BCK_REVA[4C], BCK_REVA_2[2C], BCK_REVA_2[3C], BCK_REVA_2[4C], BCK_REVA_3[2C], BCK_REVA_3[4C]), SPI_SCK (see BCK_REVA[2C], BCK_REVA[3C], BCK_REVA[4C], BCK_REVA_2[2C], BCK_REVA_2[3C], BCK_REVA_2[4C], BCK_REVA_3[3C], BCK_REVA_3[4C]), UART0_RX (see BCK_REVA[1C], BCK_REVA[2C], BCK_REVA[3C], BCK_REVA_2[1C], BCK_REVA_2[2C], BCK_REVA_2[3C], BCK_REVA_3[1C], BCK_REVA_3[2C]), UART0_RX (see BCK_REVA[1C], BCK_REVA[2C], BCK_REVA[3C], BCK_REVA_2[1C], BCK_REVA_2[2C], BCK_REVA_2[3C], BCK_REVA_3[1C], BCK_REVA_3[3C]), UART0_RX (see BCK_REVA[1C], BCK_REVA[2C], BCK_REVA[3C], BCK_REVA_2[1C], BCK_REVA_2[2C], BCK_REVA_2[3C], BCK_REVA_3[2C], BCK_REVA_3[3C]), UART0_TX (see BCK_REVA[1C], BCK_REVA[2C], BCK_REVA[3C], BCK_REVA_2[1C], BCK_REVA_2[2C], BCK_REVA_2[3C], BCK_REVA_3[1C], BCK_REVA_3[2C]), UART0_TX (see BCK_REVA[1C], BCK_REVA[2C], BCK_REVA[3C], BCK_REVA_2[1C], BCK_REVA_2[2C], BCK_REVA_2[3C], BCK_REVA_3[1C], BCK_REVA_3[3C]), UART0_TX (see BCK_REVA[1C], BCK_REVA[2C], BCK_REVA[3C], BCK_REVA_2[1C], BCK_REVA_2[2C], BCK_REVA_2[3C], BCK_REVA_3[2C], BCK_REVA_3[3C]), UART1_RX (see BCK_REVA[1C], BCK_REVA[2C], BCK_REVA[3C], BCK_REVA_2[1C], BCK_REVA_2[2C], BCK_REVA_2[3C], BCK_REVA_3[1C], BCK_REVA_3[2C]), UART1_RX (see BCK_REVA[1C], BCK_REVA[2C], BCK_REVA[3C], BCK_REVA_2[1C], BCK_REVA_2[2C], BCK_REVA_2[3C], BCK_REVA_3[1C], BCK_REVA_3[3C]), UART1_RX (see BCK_REVA[1C], BCK_REVA[2C], BCK_REVA[3C], BCK_REVA_2[1C], BCK_REVA_2[2C], BCK_REVA_2[3C], BCK_REVA_3[2C], BCK_REVA_3[3C]), UART1_TX (see BCK_REVA[1C], BCK_REVA[2C], BCK_REVA[3C], BCK_REVA_2[1C], BCK_REVA_2[2C], BCK_REVA_2[3C], BCK_REVA_3[1C], BCK_REVA_3[2C]), UART1_TX (see BCK_REVA[1C], BCK_REVA[2C], BCK_REVA[3C], BCK_REVA_2[1C], BCK_REVA_2[2C], BCK_REVA_2[3C], BCK_REVA_3[1C], BCK_REVA_3[3C]), UART1_TX (see BCK_REVA[1C], BCK_REVA[2C], BCK_REVA[3C], BCK_REVA_2[1C], BCK_REVA_2[2C], BCK_REVA_2[3C], BCK_REVA_3[2C], BCK_REVA_3[3C]), UART2_RX (see BCK_REVA[1C], BCK_REVA[2C], BCK_REVA[3C], BCK_REVA_2[1C], BCK_REVA_2[2C], BCK_REVA_2[3C], BCK_REVA_3[1C], BCK_REVA_3[2C]), UART2_RX (see BCK_REVA[1C], BCK_REVA[2C], BCK_REVA[3C], BCK_REVA_2[1C], BCK_REVA_2[2C], BCK_REVA_2[3C], BCK_REVA_3[1C], BCK_REVA_3[3C]), UART2_RX (see BCK_REVA[1C], BCK_REVA[2C], BCK_REVA[3C], BCK_REVA_2[1C], BCK_REVA_2[2C], BCK_REVA_2[3C], BCK_REVA_3[2C], BCK_REVA_3[3C]), UART2_TX (see BCK_REVA[1C], BCK_REVA[2C], BCK_REVA[3C], BCK_REVA_2[1C], BCK_REVA_2[2C], BCK_REVA_2[3C], BCK_REVA_3[1C], BCK_REVA_3[2C]), UART2_TX (see BCK_REVA[1C], BCK_REVA[2C], BCK_REVA[3C], BCK_REVA_2[1C], BCK_REVA_2[2C], BCK_REVA_2[3C], BCK_REVA_3[1C], BCK_REVA_3[3C]), UART2_TX (see BCK_REVA[1C], BCK_REVA[2C], BCK_REVA[3C], BCK_REVA_2[1C], BCK_REVA_2[2C], BCK_REVA_2[3C], BCK_REVA_3[2C], BCK_REVA_3[3C]), UART3_RX (see BCK_REVA[1B], BCK_REVA[2B], BCK_REVA[3B], BCK_REVA_2[1B], BCK_REVA_2[2B], BCK_REVA_2[3B], BCK_REVA_3[1B], BCK_REVA_3[2B]), UART3_RX (see BCK_REVA[1B], BCK_REVA[2B], BCK_REVA[3B], BCK_REVA_2[1B], BCK_REVA_2[2B], BCK_REVA_2[3B], BCK_REVA_3[1B], BCK_REVA_3[3B]), UART3_RX (see BCK_REVA[1B], BCK_REVA[2B], BCK_REVA[3B], BCK_REVA_2[1B], BCK_REVA_2[2B], BCK_REVA_2[3B], BCK_REVA_3[2B], BCK_REVA_3[3B]), UART3_TX (see BCK_REVA[1B], BCK_REVA[2B], BCK_REVA[3B], BCK_REVA_2[1B], BCK_REVA_2[2B], BCK_REVA_2[3B], BCK_REVA_3[1B], BCK_REVA_3[2B]), UART3_TX (see BCK_REVA[1B], BCK_REVA[2B], BCK_REVA[3B], BCK_REVA_2[1B], BCK_REVA_2[2B], BCK_REVA_2[3B], BCK_REVA_3[1B], BCK_REVA_3[3B]), UART3_TX (see BCK_REVA[1B], BCK_REVA[2B], BCK_REVA[3B], BCK_REVA_2[1B], BCK_REVA_2[2B], BCK_REVA_2[3B], BCK_REVA_3[2B], BCK_REVA_3[3B])

## Nets
GND: D7.1(K) D8.1(K) D9.1(K)
+3.3V: J7.03 J7.04 J7.73 J7.74 J7.75 J7.76 J8.03 J8.04 J8.73 J8.74 J8.75 J8.76 J9.03 J9.04 J9.73 J9.74 J9.75 J9.76 ; port +3.3V
+5V: J7.01 J7.02 J8.01 J8.02 J9.01 J9.02 ; port +5V
A0: J7.22 J8.22 J9.22 ; port A0
A1: J7.20 J8.20 J9.20 ; port A1
A2: J7.18 J8.18 J9.18 ; port A2
A3: J7.16 J8.16 J9.16 ; port A3
A4: J7.14 J8.14 J9.14 ; port A4
A5: J7.12 J8.12 J9.12 ; port A5
A6: J7.10 J8.10 J9.10 ; port A6
A7: J7.08 J8.08 J9.08 ; port A7
A12: J7.31 J8.31 J9.31 ; port A12
A13: J7.33 J8.33 J9.33 ; port A13
DAC0: J7.41 J8.41 J9.41 ; port DAC0
DAC1: J7.37 J8.37 J9.37 ; port DAC1
GND: J7.06 J7.17 J7.21 J7.24 J7.25 J7.32 J7.35 J7.39 J7.43 J7.45 J7.60 J7.63 J7.64 J7.67 J7.68 J7.71 J7.72 J7.77 J8.06 J8.17 J8.21 J8.24 J8.25 J8.32 J8.35 J8.39 J8.43 J8.45 J8.60 J8.63 J8.64 J8.67 J8.68 J8.71 J8.72 J8.77 J9.06 J9.17 J9.21 J9.24 J9.25 J9.32 J9.35 J9.39 J9.43 J9.45 J9.60 J9.63 J9.64 J9.67 J9.68 J9.71 J9.72 J9.77 ; port GND  [a separate net that carries the same name]
GPIO0: J7.58 J8.58 J9.58 ; port GPIO0
GPIO1: J7.56 J8.56 J9.56 ; port GPIO1
GPIO2: J7.54 J8.54 J9.54 ; port GPIO2
GPIO3: J7.52 J8.52 J9.52 ; port GPIO3
GPIO4: J7.50 J8.50 J9.50 ; port GPIO4
GPIO5: J7.48 J8.48 J9.48 ; port GPIO5
GPIO6: J7.46 J8.46 J9.46 ; port GPIO6
GPIO7: J7.44 J8.44 J9.44 ; port GPIO7
GPIO8: J7.42 J8.42 J9.42 ; port GPIO8
GPIO9: J7.40 J8.40 J9.40 ; port GPIO9
GPIO10: J7.38 J8.38 J9.38 ; port GPIO10
GPIO11: J7.36 J8.36 J9.36 ; port GPIO11
GPIO12: J7.34 J8.34 J9.34 ; port GPIO12
GPIO13: J7.30 J8.30 J9.30 ; port GPIO13
GPIO14: J7.28 J8.28 J9.28 ; port GPIO14
GPIO15: J7.26 J8.26 J9.26 ; port GPIO15
GPIO22: J7.27 J8.27 J9.27 ; port GPIO22
GPIO23: J7.29 J8.29 J9.29 ; port GPIO23
I2C0_SCL: J7.69 J8.69 J9.69 ; port I2C0_SCL
I2C0_SDA: J7.65 J8.65 J9.65 ; port I2C0_SDA
I2C1_SCL: J7.23 J8.23 J9.23 ; port I2C1_SCL
I2C1_SDA: J7.19 J8.19 J9.19 ; port I2C1_SDA
PORT0: J7.15 J8.15 J9.15 ; port PORT0
PORT1: J7.13 J8.13 J9.13 ; port PORT1
PORT2: J7.11 J8.11 J9.11 ; port PORT2
PORT3: J7.09 J8.09 J9.09 ; port PORT3
PORT4: J7.07 J8.07 J9.07 ; port PORT4
PORT5: J7.05 J8.05 J9.05 ; port PORT5
SLOT7LED: J7.78 R7.1 ; port SLOT7LED
SLOT8LED: J8.78 R8.1 ; port SLOT8LED
SLOT9LED: J9.78 R9.1 ; port SLOT9LED
SPI_MISO: J7.62 J8.62 J9.62 ; port SPI_MISO
SPI_MOSI: J7.66 J8.66 J9.66 ; port SPI_MOSI
SPI_SCK: J7.70 J8.70 J9.70 ; port SPI_SCK
UART0_RX: J7.61 J8.61 J9.61 ; port UART0_RX
UART0_TX: J7.59 J8.59 J9.59 ; port UART0_TX
UART1_RX: J7.57 J8.57 J9.57 ; port UART1_RX
UART1_TX: J7.55 J8.55 J9.55 ; port UART1_TX
UART2_RX: J7.53 J8.53 J9.53 ; port UART2_RX
UART2_TX: J7.51 J8.51 J9.51 ; port UART2_TX
UART3_RX: J7.49 J8.49 J9.49 ; port UART3_RX
UART3_TX: J7.47 J8.47 J9.47 ; port UART3_TX
NetD7_2: D7.2(A) R7.2
NetD8_2: D8.2(A) R8.2
NetD9_2: D9.2(A) R9.2

## Library data of the parts
D7-D9 = KP_DELPS1.FP-QISI-34-U515-2-S: High Power LEDs - Single Color Pure Green TOPLED E1608; Manufacturer_Name: AMS OSRAM GROUP; Manufacturer_Part_Number: KP DELPS1.FP-QISI-34-U515-2-S; Geometry.Height: 0.7mm; Mouser Part Number: 720-KPDELPS1FPA0817; Mouser Price/Stock: https://www.mouser.co.uk/ProductDetail/ams-OSRAM/KP-DELPS1FP-QISI-34-U515-2-S?qs=CiayqK2gdcI39hBNO3GmaQ%3D%3D; Arrow Part Number: *; Arrow Price/Stock: *; Mouser Testing Part Number: *; Mouser Testing Price/Stock: *; Datasheet Link: https://www.dialog-semiconductor.com/sites/default/files/2021-09/DA14531_datasheet_3v4.pdf
J7-J9 = MECF-40-01-X-DV-WT: MECF .050" EDGE CARD ASSEMBLY; MF: Samtec; Price: None; MP: MECF-40-01-X-DV-WT; Value: *; Availability: Unavailable; Package: None
R7-R9 = CMP-2001-00608-1: Manufacturer: Panasonic; Part Number: ERA6AEB201V